# EAGLE design LightSchematic (EAGLE 9.2.0)
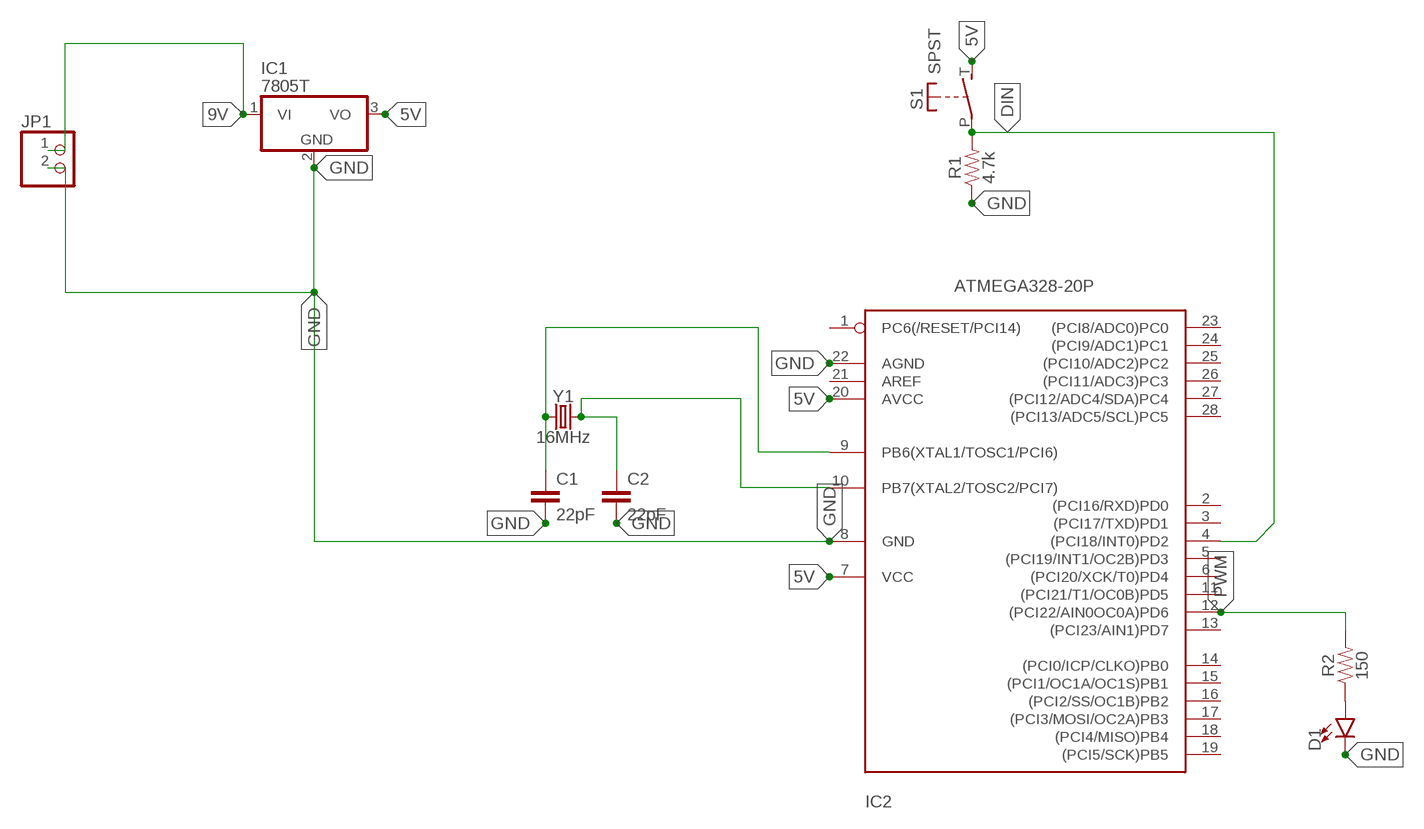
[diagram p0: schematic, sheet 1]

## Parts
C1  22pF  22PF-0603-50V-5%  [0603]
C2  22pF  22PF-0603-50V-5%  [0603]
D1  LED1206  [LED-1206]
IC1  7805T  [TO220H]
IC2  ATMEGA328-20P  [DIL28-3]
JP1  PINHD-1X2  [1X02]
R1  4.7k  100KOHM-0402-1/16W-1%  [0402]
R2  150  100KOHM-0402-1/16W-1%  [0402]
S1  SPST  [JUDCOSPST]
Y1  16MHz  CRYSTAL-16MHZPTH-HC49US  [HC49US]

## Nets
5V: IC1.3(VO) IC2.7(VCC) IC2.20(AVCC) S1.T(S)
9V: IC1.1(VI) JP1.1
DIN: IC2.4((PCI18/INT0)PD2) R1.2 S1.P
GND: C1.2 C2.2 D1.C IC1.2(GND) IC2.8(GND) IC2.22(AGND) JP1.2 R1.1
N$1: C1.1 IC2.9(PB6(XTAL1/TOSC1/PCI6)) Y1.1
N$2: C2.1 IC2.10(PB7(XTAL2/TOSC2/PCI7)) Y1.2
N$3: D1.A R2.1
PWM: IC2.12((PCI22/AIN0OC0A)PD6) R2.2
Unconnected: IC2.1(PC6(/RESET/PCI14)) IC2.2((PCI16/RXD)PD0) IC2.3((PCI17/TXD)PD1) IC2.5((PCI19/INT1/OC2B)PD3) IC2.6((PCI20/XCK/T0)PD4) IC2.11((PCI21/T1/OC0B)PD5) IC2.13((PCI23/AIN1)PD7) IC2.14((PCI0/ICP/CLKO)PB0) IC2.15((PCI1/OC1A/OC1S)PB1) IC2.16((PCI2/SS/OC1B)PB2) IC2.17((PCI3/MOSI/OC2A)PB3) IC2.18((PCI4/MISO)PB4) IC2.19((PCI5/SCK)PB5) IC2.21(AREF) IC2.23((PCI8/ADC0)PC0) IC2.24((PCI9/ADC1)PC1) IC2.25((PCI10/ADC2)PC2) IC2.26((PCI11/ADC3)PC3) IC2.27((PCI12/ADC4/SDA)PC4) IC2.28((PCI13/ADC5/SCL)PC5)

## Library data of the parts
C1 C2 = SparkFun-Capacitors:22PF: 22pF ceramic capacitors A capacitor is a passive two-terminal electrical component used to store electrical energy temporarily in an electric field.; PROD_ID: CAP-07876
D1 = SparkFun-LED:LED: LED (Generic) Standard schematic elements and footprints for 5mm, 3mm, 1206, and 0603 sized LEDs. Generic LEDs with no color specified.
IC1 = linear:78*: Positive VOLTAGE REGULATOR Source: http://cache.national.com/ds/LM/LM78L05.pdf http://www.fairchildsemi.com/ds/LM/LM7805.pdf
IC2 = atmega328:ATMEGA328*P: MICROCONTROLLER 32 kBytes FLASH 2 kBytes SRAM 1 kBytes EEPROM USART 8-channel 10 bit ADC
JP1 = pinhead:PINHD-1X2: PIN HEADER
R1 R2 = SparkFun-Resistors:100KOHM: 100kΩ resistor A resistor is a passive two-terminal electrical component that implements electrical resistance as a circuit element. Resistors act to reduce current flow, and, at the same time, act to lower voltage levels within circuits. - Wikipedia; PROD_ID: RES-13495; VALUE: 100K
S1 = adafruit:SPST: Judco 50-0015-00
Y1 = SparkFun-Clocks:CRYSTAL-16MHZ: 16MHz Crystal Digikey Example <http://www.digikey.com/product-search/en?keywords=535-9122-1-ND> Frequency: 16MHz Frequency Stability: ±50ppm Frequency Tolerance: ±20ppm Load Capacitance: 18pF SparkFun Products: Pro Micro -5V/16MHz <https://www.sparkfun.com/products/12640> SparkFun Serial Enabled LCD Kit <https://www.sparkfun.com/products/10097>; PROD_ID: XTAL-08181; SF_ID: COM-00536

## Board
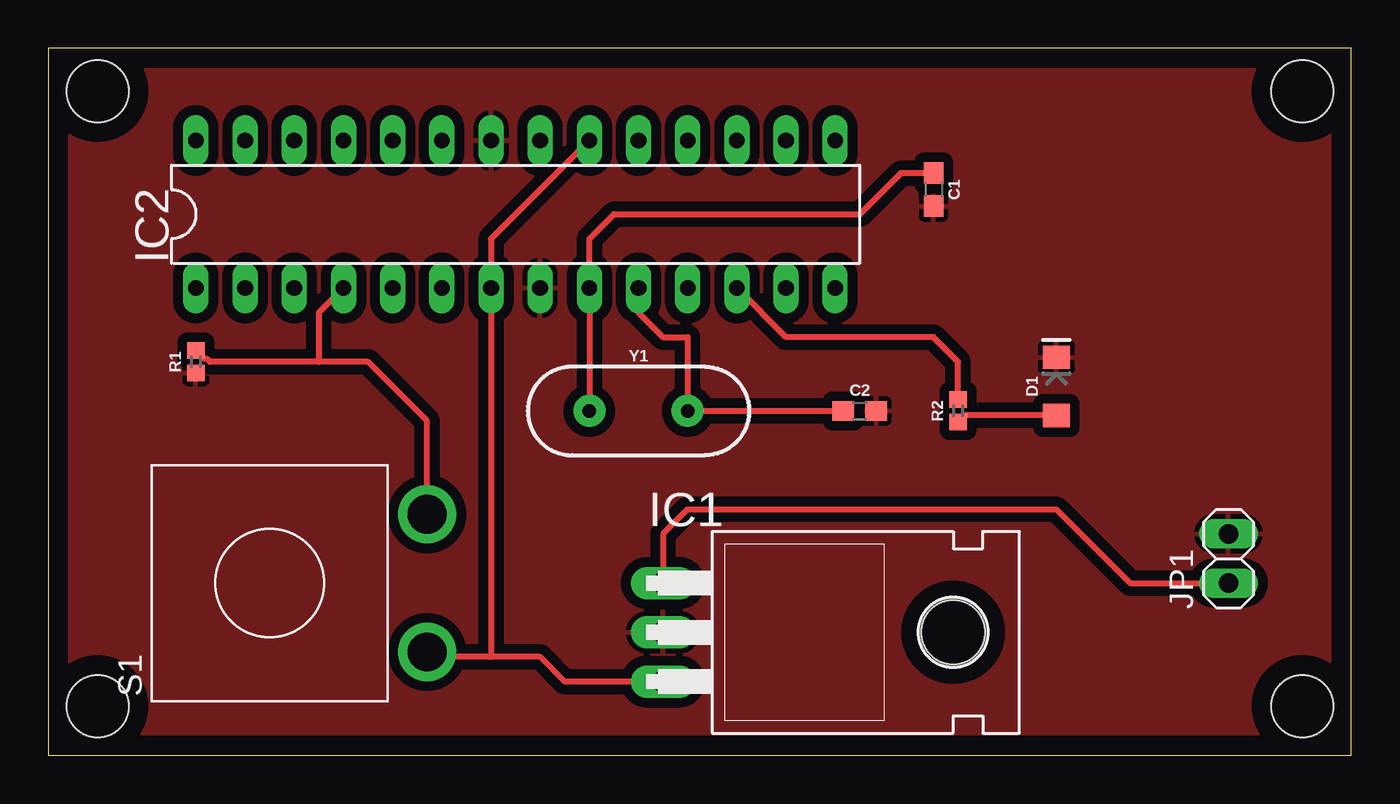
[diagram p1: board, top side]
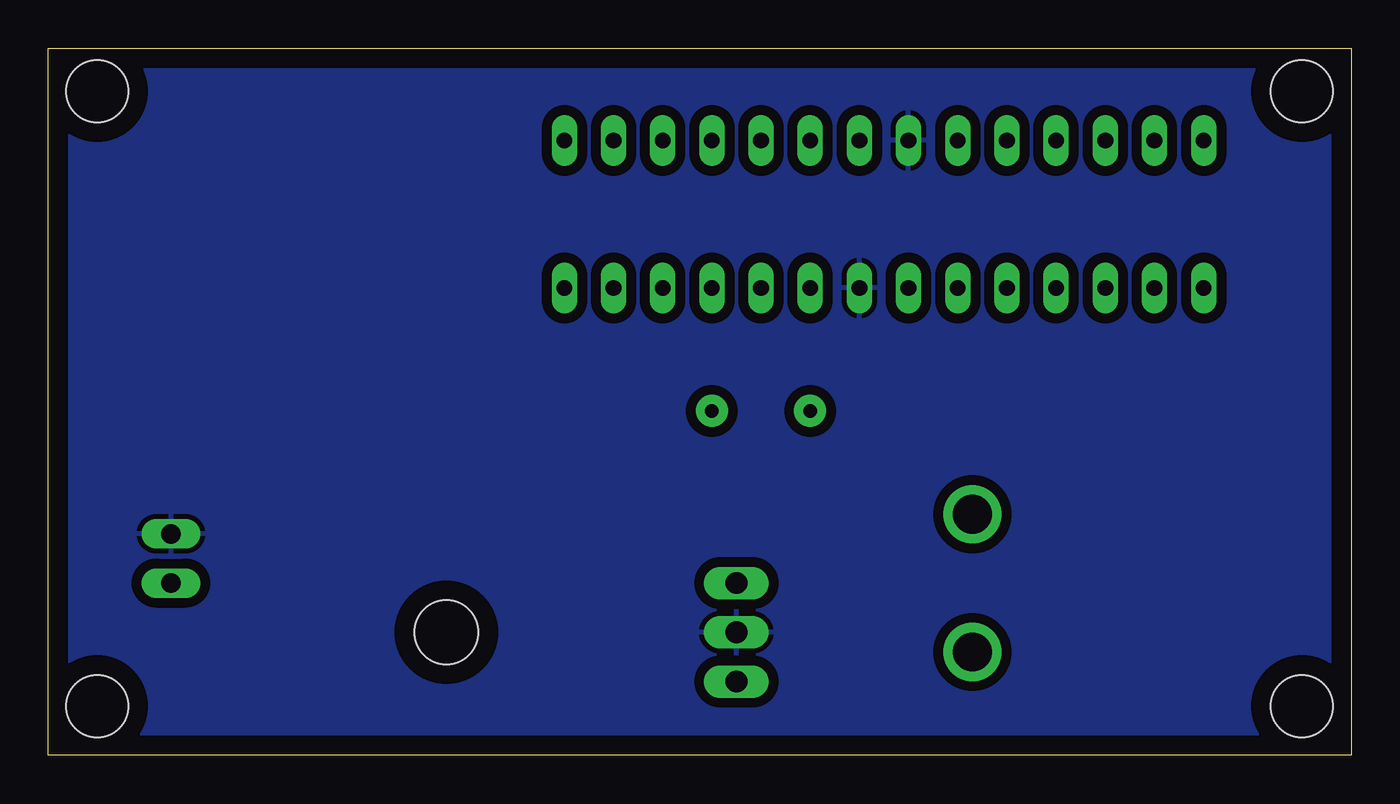
[diagram p2: board, bottom side, seen from below]

Size 67.29 x 36.5 mm. Coordinates in mm from the lower left corner, seen from the top.
Outline: 0,0 67.29,0 67.29,36.5 0,36.5 0,0
Copper layers (1*16): Top 0.035mm / dielectric 1.5mm / Bottom 0.035mm
Design rules "default *": minimum track width 12mil, minimum drill 0.35mm, track to track 20mil, track to pad 6mil, pad to pad 6mil, via to via 6mil, smd to smd 6mil, copper to edge 40mil, drill to drill 6mil, minimum pad ring 10mil, minimum via ring 8mil, stop-mask expansion 4mil, vias tented up to drill 0mil, thermal gap 10mil
Holes 3.2 mm at 64.77,34.29 64.77,2.54 2.54,2.54 2.54,34.29

### Footprints (pad centres in the part's own frame; a part is rotated, then mirrored left to right if it is on the bottom)
0603 = smd 1.1 x 1: 1 -0.85,0; 2 0.85,0
LED-1206 = smd 1.2 x 1.4: A -1.5,0; C 1.5,0
TO220H = drill 1.118 long: 1 -2.54,-10.16; 2 0,-10.16; 3 2.54,-10.16 | hole 3.302: 0,4.826
DIL28-3 = drill 0.813 long: 1 -16.51,-3.81; 2 -13.97,-3.81; 3 -11.43,-3.81; 4 -8.89,-3.81; 5 -6.35,-3.81; 6 -3.81,-3.81; 7 -1.27,-3.81; 8 1.27,-3.81; 9 3.81,-3.81; 10 6.35,-3.81; 11 8.89,-3.81; 12 11.43,-3.81; 13 13.97,-3.81; 14 16.51,-3.81; 15 16.51,3.81; 16 13.97,3.81; 17 11.43,3.81; 18 8.89,3.81; 19 6.35,3.81; 20 3.81,3.81; 21 1.27,3.81; 22 -1.27,3.81; 23 -3.81,3.81; 24 -6.35,3.81; 25 -8.89,3.81; 26 -11.43,3.81; 27 -13.97,3.81; 28 -16.51,3.81
1X02 = drill 1.016 long: 1 -1.27,0; 2 1.27,0
0402 = smd 0.85 x 0.9: 1 -0.58,0; 2 0.58,0
JUDCOSPST = drill 2: P 3.556,-8.128; T -3.556,-8.128
HC49US = drill 0.7 pad 1.651: 1 -2.54,0; 2 2.54,0

### Placement (x,y rotation side)
C1  45.72,29.21 270 top
C2  41.91,17.78 0 top
D1  52.07,19.05 90 top
IC1  41.91,6.35 270 top
IC2  24.13,27.94 0 top
JP1  60.96,10.16 90 top
R1  7.62,20.32 90 top
R2  46.99,17.78 90 top
S1  11.43,8.89 90 top
Y1  30.48,17.78 0 top

### Tracks (layer width: path | path; a pad name or v marks a point on that pad's centre or on a via)
5V
  Top 0.305: IC2.20 22.86,26.67 IC2.7 22.86,5.08 | 22.86,5.08 19.81,5.08 S1.T | IC1.3 26.67,3.81 25.4,5.08 22.86,5.08
9V
  Top 0.305: IC1.1 31.75,11.43 33.02,12.7 52.07,12.7 55.88,8.89 JP1.1
DIN
  Top 0.305: IC2.4 13.97,22.86 13.97,20.32 | 13.97,20.32 8.35,20.32 8.2,20.47 8.05,20.47 R1.2 | S1.P 19.56,17.27 16.51,20.32 13.97,20.32
GND
  pour Top: 0,36.83 0,0 1.27,-1.27 68.58,-1.27 69.85,0 69.85,35.56 67.31,38.1 1.27,38.1
  pour Bottom: -1.27,35.56 -1.27,0 0,-1.27 67.31,-1.27 68.58,0 68.58,39.37 67.31,40.64 3.81,40.64
N$1
  Top 0.305: Y1.1 IC2.9 27.94,26.67 29.21,27.94 41.91,27.94 44.03,30.06 C1.1
N$2
  Top 0.305: IC2.10 30.48,22.86 31.75,21.59 33.02,21.59 Y1.2 C2.1
N$3
  Top 0.305: D1.A 47.34,17.55 R2.1
PWM
  Top 0.305: R2.2 46.99,20.32 45.72,21.59 38.1,21.59 IC2.12